# Altium schematic sheet Main.SchDoc
size A4; SheetNumber: 1; SheetTotal: 1
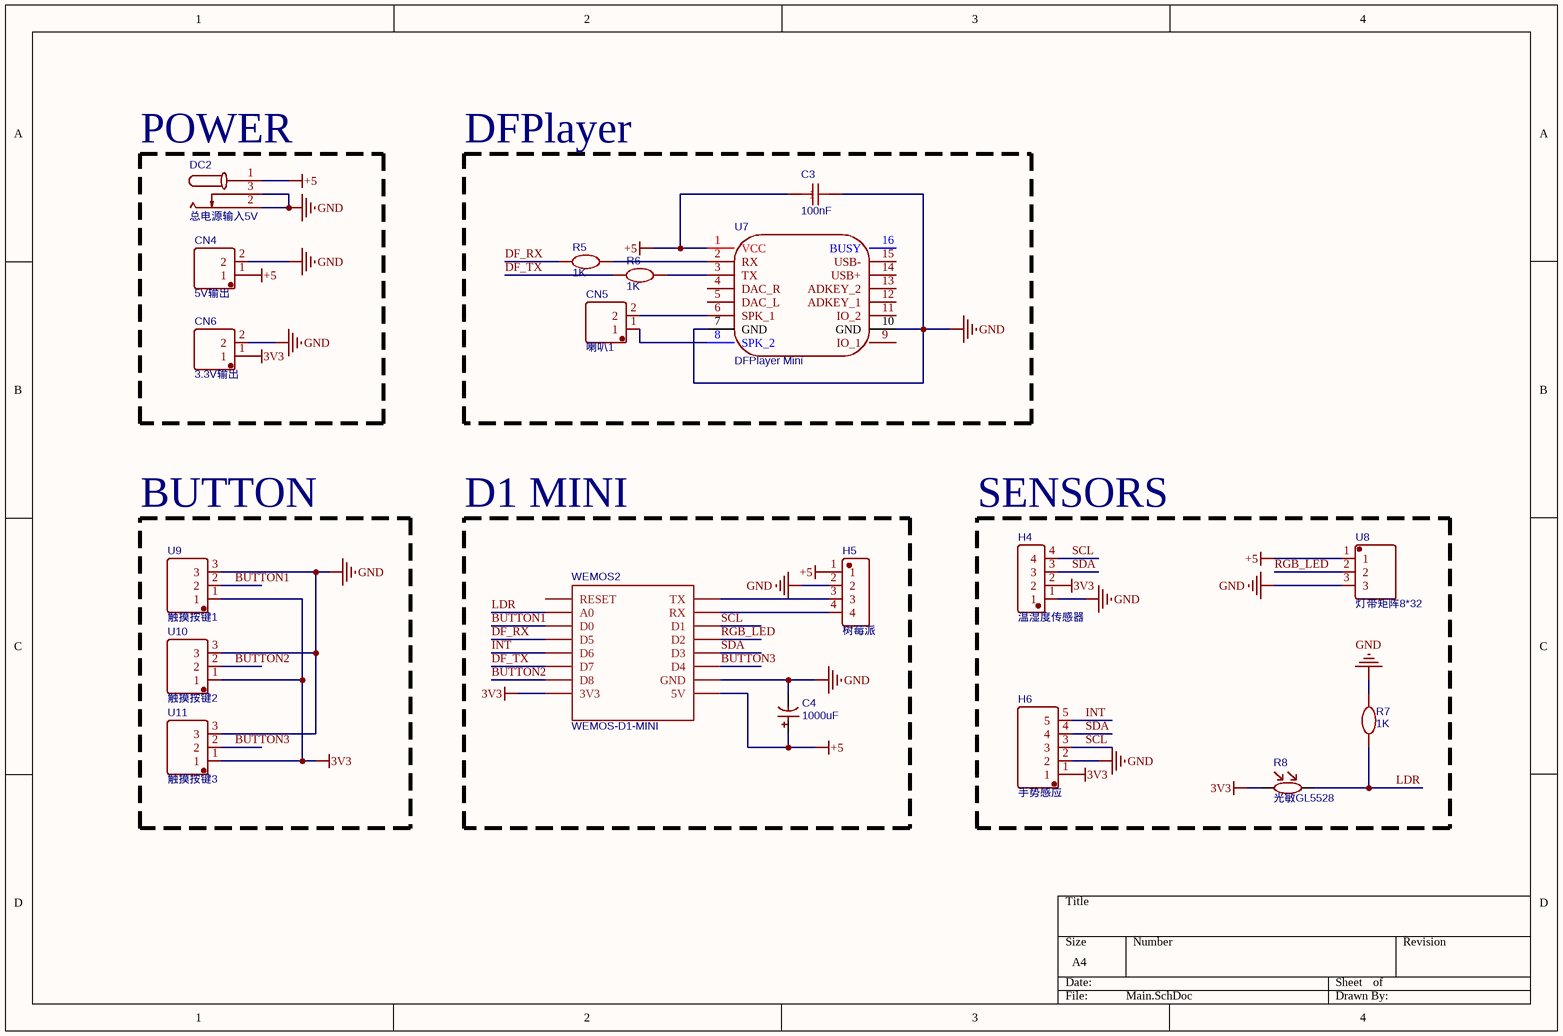
[diagram p0: Main.SchDoc]

## Parts
C3  100nF  [CAP-SMD_BD6.3-L6.6-W6.6-LS7.2-FD]
C4  1000uF  [1000uf25v]
CN4  5V输出  [HDR-TH_2P-P2.54-V]
CN5  喇叭1  [HDR-TH_2P-P2.54-V]
CN6  3.3V输出  [HDR-TH_2P-P2.54-V]
DC2  总电源输入5V  [DC-IN-TH_DC005]
H4  温湿度传感器  [HDR-TH_4P-P2.54-V]
H5  树莓派  [HDR-TH_4P-P2.54-V]
H6  手势感应  [HDR-TH_5P-P2.54-V]
R5  1K  [0805_R]
R6  1K  [0805_R]
R7  1K  [0805_R]
R8  光敏GL5528  [RES-TH_L5.1-W4.3-P3.40-D0.5]
U7  DFPlayer Mini  [DFPLAYER MINI]
U8  灯带矩阵8*32  [HDR-TH_3P-P2.54-V]
U9  触摸按键1  [HDR-TH_3P-P2.54-V]
U10  触摸按键2  [HDR-TH_3P-P2.54-V]
U11  触摸按键3  [HDR-TH_3P-P2.54-V]
WEMOS2  WEMOS-D1-MINI  [WEMOS_D1_MINI_V2.3.0]

## Blocks framed on the sheet
POWER: CN4 CN6 DC2
DFPlayer: C3 CN5 R5 R6 U7
BUTTON: U9-U11
D1 MINI: C4 H5 WEMOS2
SENSORS: H4 H6 R7 R8 U8

## Nets
3V3: CN6.1 H4.2 H6.1 R8.1 U9.1 U10.1 U11.1 WEMOS2.3V3
+5: C3.1 C4.1 CN4.1 DC2.1 H5.1 U7.1(VCC) U8.1 WEMOS2.5V
GND: C3.2 C4.2 CN4.2 CN6.2 DC2.2 DC2.3 H4.1 H5.2 H6.2 R7.2 U7.7(GND) U7.10(GND) U8.3 U9.3 U10.3 U11.3 WEMOS2.GND
BUTTON1: U9.2 WEMOS2.D0
BUTTON2: U10.2 WEMOS2.D8
BUTTON3: U11.2 WEMOS2.D4
DF_RX: R5.1 WEMOS2.D5
DF_TX: R6.1 WEMOS2.D7
INT: H6.5 WEMOS2.D6
LDR: R7.1 R8.2 WEMOS2.A0
RGB_LED: U8.2 WEMOS2.D2
SCL: H4.4 H6.3 WEMOS2.D1
SDA: H4.3 H6.4 WEMOS2.D3
NetCN5_1: CN5.1 U7.8(SPK_2)
NetCN5_2: CN5.2 U7.6(SPK_1)
NetH5_3: H5.3 WEMOS2.TX
NetH5_4: H5.4 WEMOS2.RX
NetR5_2: R5.2 U7.2(RX)
NetR6_2: R6.2 U7.3(TX)

Not connected (* = marked no-connect by the designer): U7 4(DAC_R) 5(DAC_L) 9(IO_1) 11(IO_2) 12(ADKEY_1) 13(ADKEY_2) 14(USB+) 15(USB-) 16(BUSY); WEMOS2 RESET

## Library data of the parts
C3 = 100nF: BOM_Manufacturer: Taiyo Yuden; BOM_Manufacturer Part: UMK107B104KAHT; nameAlias: Capacitance; Contributor: LCSC; BOM_Supplier: LCSC; BOM_Supplier Part: C386152; spicePre: C; spiceSymbolName: UMK107B104KAHT
C4 = 1000uF: BOM_Manufacturer: ValuePro; BOM_Manufacturer Part: 1000uF 16V; nameAlias: Capacitance; BOM_Supplier: LCSC; BOM_Supplier Part: C43909; spicePre: C; spiceSymbolName: 1000uF 16V
CN4 = 5V输出: BOM_Manufacturer: JST Sales America; Contributor: LCSC; BOM_Supplier: LCSC; BOM_Supplier Part: C160332; BOM_Manufacturer Part: -; spicePre: C; spiceSymbolName: RE-H022TD-1190 (LF)(SN)
CN5 = 喇叭1: BOM_Manufacturer: JST Sales America; Contributor: LCSC; BOM_Supplier: LCSC; BOM_Supplier Part: C160332; BOM_Manufacturer Part: -; spicePre: C; spiceSymbolName: RE-H022TD-1190 (LF)(SN)
CN6 = 3.3V输出: BOM_Manufacturer: JST Sales America; Contributor: LCSC; BOM_Supplier: LCSC; BOM_Supplier Part: C160332; BOM_Manufacturer Part: -; spicePre: C; spiceSymbolName: RE-H022TD-1190 (LF)(SN)
DC2 = 总电源输入5V: BOM_Manufacturer: Shenzhen Cankemeng; Contributor: LCSC; BOM_Supplier: LCSC; BOM_Supplier Part: C132516; BOM_Manufacturer Part: -; spicePre: D; spiceSymbolName: dc-005 5.5-2.0
H4 = i2C: BOM_Manufacturer: ZHENGLING; BOM_Manufacturer Part: Z-211-0411-0021-001; Contributor: LCSC; BOM_Supplier: LCSC; BOM_Supplier Part: C152150; spicePre: H; spiceSymbolName: Z-211-0411-0021-001
H5 = 树莓派: BOM_Manufacturer: ZHENGLING; BOM_Manufacturer Part: Z-211-0411-0021-001; Contributor: LCSC; BOM_Supplier: LCSC; BOM_Supplier Part: C152150; spicePre: H; spiceSymbolName: Z-211-0411-0021-001
H6 = 手势感应: BOM_Manufacturer: Amphenol ICC; BOM_Manufacturer Part: 77311-462K05LF; Contributor: LCSC; BOM_Supplier: LCSC; BOM_Supplier Part: C180219; spicePre: H; spiceSymbolName: 77311-462K05LF
R5-R7 = 1K: BOM_Manufacturer: TyoHM; BOM_Manufacturer Part: RN 1/8W 1K F T/B A1; nameAlias: Resistance (Ohms); Contributor: LCSC; BOM_Supplier: LCSC; BOM_Supplier Part: C433503; spicePre: R; spiceSymbolName: RN 1/8W 1K F T/B A1
R8 = 光敏GL5528: BOM_Manufacturer: Senba; BOM_Manufacturer Part: GL5528; nameAlias: Value; BOM_Supplier: LCSC; BOM_Supplier Part: C125627; spicePre: R; spiceSymbolName: GL5528
U7 = DFPlayer Mini: Contributor: adrirobot; sourceId: cKDVP7pjB; timeStamp: 1464108735; spicePre: U; spiceSymbolName: DFPlayer Mini
U8 = 灯带矩阵8*32: BOM_Manufacturer: JST Sales America; BOM_Manufacturer Part: RE-H032TD-1130; Contributor: LCSC; BOM_Supplier: LCSC; BOM_Supplier Part: C265013; spicePre: U; spiceSymbolName: RE-H032TD-1130
U9 = 触摸按键1: BOM_Manufacturer: JST Sales America; BOM_Manufacturer Part: RE-H032TD-1130; Contributor: LCSC; BOM_Supplier: LCSC; BOM_Supplier Part: C265013; spicePre: U; spiceSymbolName: RE-H032TD-1130
U10 = 触摸按键2: BOM_Manufacturer: JST Sales America; BOM_Manufacturer Part: RE-H032TD-1130; Contributor: LCSC; BOM_Supplier: LCSC; BOM_Supplier Part: C265013; spicePre: U; spiceSymbolName: RE-H032TD-1130
U11 = 触摸按键3: BOM_Manufacturer: JST Sales America; BOM_Manufacturer Part: RE-H032TD-1130; Contributor: LCSC; BOM_Supplier: LCSC; BOM_Supplier Part: C265013; spicePre: U; spiceSymbolName: RE-H032TD-1130
WEMOS2 = WEMOS-D1-MINI: spicePre: W; spiceSymbolName: WEMOS-D1-MINI